# Altium schematic sheet USB.SchDoc
size A4; SheetNumber: 4; SheetTotal: 7
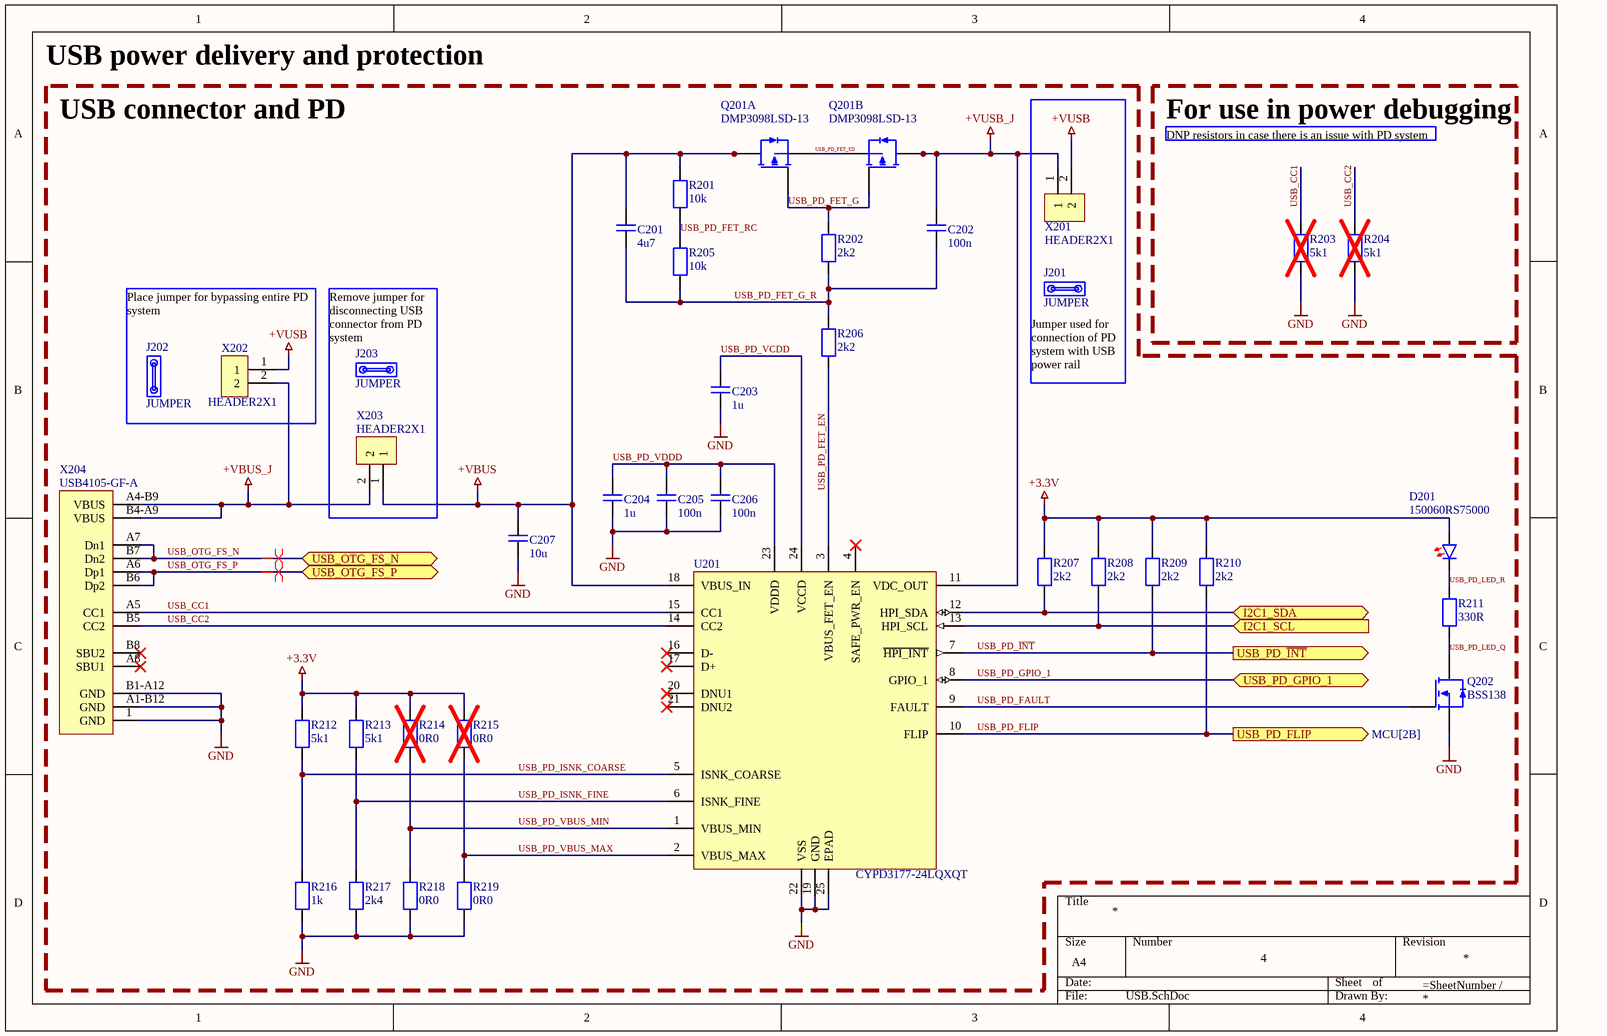
[diagram p0: USB.SchDoc]

## Parts
C201  4u7  [CAPC0603]
C202  100n  [CAPC0603]
C203  1u  [CAPC0603]
C204  1u  [CAPC0603]
C205  100n  [CAPC0603]
C206  100n  [CAPC0603]
C207  10u  [CAPC0603]
D201  150060RS75000  [LED0603]
J201  JUMPER  (mechanical)
J202  JUMPER  (mechanical)
J203  JUMPER  (mechanical)
Q201  DMP3098LSD-13  [SOIC127P620X175-8]  (parts A,B of 2)
Q202  BSS138  [SOT190P240X290-3]
R201  10k  [RESC0603]
R202  2k2  [RESC0603]
R203  5k1  [RESC0603]
R204  5k1  [RESC0603]
R205  10k  [RESC0603]
R206  2k2  [RESC0603]
R207  2k2  [RESC0603]
R208  2k2  [RESC0603]
R209  2k2  [RESC0603]
R210  2k2  [RESC0603]
R211  330R  [RESC0603]
R212  5k1  [RESC0603]
R213  5k1  [RESC0603]
R214  0R0  [RESC0603]
R215  0R0  [RESC0603]
R216  1k  [RESC0603]
R217  2k4  [RESC0603]
R218  0R0  [RESC0603]
R219  0R0  [RESC0603]
U201  CYPD3177-24LQXQT  [QFN50P410X410X100-24EP]
X201  HEADER2X1  [HDRV2W64P254_2X1_508X254X1150]
X202  HEADER2X1  [HDRV2W64P254_2X1_508X254X1150]
X203  HEADER2X1  [HDRV2W64P254_2X1_508X254X1150]
X204  USB4105-GF-A  [GCT_USB4105-GF-A]

## Blocks framed on the sheet
For use in power debugging: R203 R204

## Ports
I2C1_SCL (in, see MCU[1B]), I2C1_SDA (bidir, see MCU[1B]), USB_OTG_FS_N (bidir, see MCU[1B]), USB_OTG_FS_P (bidir, see MCU[1B]), USB_PD_FLIP (out, see MCU[2B]), USB_PD_GPIO_1 (bidir, see MCU[2B]), USB_PD_~{INT} (out, see MCU[2B])

## Nets
+3.3V: D201.2 R207.2 R208.2 R209.2 R210.2 R212.2 R213.2 R214.2 R215.2
+VBUS: C201.2 C207.2 Q201.7(D1) Q201.8(D1) R201.2 U201.18(VBUS_IN) X203.1
+VBUS_J: X202.2 X203.2 X204.A4-B9(VBUS) X204.B4-A9(VBUS)
+VUSB: X201.2 X202.1
+VUSB_J: C202.2 Q201.5(D2) Q201.6(D2) U201.11(VDC_OUT) X201.1
GND: C203.1 C204.1 C205.1 C206.1 C207.1 Q202.2(S) R203.1 R204.1 R216.1 R217.1 R218.1 R219.1 U201.19(GND) U201.22(VSS) U201.25(EPAD) X204.1(GND) X204.A1-B12(GND) X204.B1-A12(GND)
I2C1_SCL: R208.1 U201.13(HPI_SCL) ; port I2C1_SCL
I2C1_SDA: R207.1 U201.12(HPI_SDA) ; port I2C1_SDA
USB_CC1: R203.2 U201.15(CC1) X204.A5(CC1)
USB_CC2: R204.2 U201.14(CC2) X204.B5(CC2)
USB_OTG_FS_N: X204.A7(Dn1) X204.B7(Dn2) ; port USB_OTG_FS_N
USB_OTG_FS_P: X204.A6(Dp1) X204.B6(Dp2) ; port USB_OTG_FS_P
USB_PD_FAULT: Q202.1(G) U201.9(FAULT)
USB_PD_FET_EN: R206.1 U201.3(VBUS_FET_EN)
USB_PD_FET_G: Q201.2(G1) Q201.4(G2) R202.2
USB_PD_FET_G_R: C201.1 C202.1 R202.1 R205.1 R206.2
USB_PD_FET_RC: R201.1 R205.2
USB_PD_FET_SD: Q201.1(S1) Q201.3(S2)
USB_PD_FLIP: R210.1 U201.10(FLIP) ; port USB_PD_FLIP
USB_PD_GPIO_1: U201.8(GPIO_1) ; port USB_PD_GPIO_1
USB_PD_~{INT}: R209.1 U201.7(~{HPI_INT}) ; port USB_PD_~{INT}
USB_PD_ISNK_COARSE: R212.1 R216.2 U201.5(ISNK_COARSE)
USB_PD_ISNK_FINE: R213.1 R217.2 U201.6(ISNK_FINE)
USB_PD_LED_Q: Q202.3(D) R211.1
USB_PD_LED_R: D201.1 R211.2
USB_PD_VBUS_MAX: R215.1 R219.2 U201.2(VBUS_MAX)
USB_PD_VBUS_MIN: R214.1 R218.2 U201.1(VBUS_MIN)
USB_PD_VCDD: C203.2 U201.24(VCCD)
USB_PD_VDDD: C204.2 C205.2 C206.2 U201.23(VDDD)

Not connected (* = marked no-connect by the designer): U201 4(SAFE_PWR_EN)* 16(D-)* 17(D+)* 20(DNU1)* 21(DNU2)*; X204 A8(SBU1)* B8(SBU2)*

## Layout directives
differential pair: USB_OTG_FS_N, USB_OTG_FS_P

## Notes on the sheet
- USB power delivery and protection
- USB connector and PD
- DNP resistors in case there is an issue with PD system
- Jumper used for connection of PD system with USB power rail
- Place jumper for bypassing entire PD system
- Remove jumper for disconnecting USB connector from PD system

## Library data of the parts
C201-C207 = CAPC0603: Ceramic capacitor, VAL?,  VOL?, DIEL?; Checked: Yes; MFR: ?; Supplier: Digi-Key; SPN: ?; MFRN: ?; LCSC Part Number: ?
  C201: Value: 4u7
  C202 C205 C206: Value: 100n
  C203 C204: Value: 1u
  C207: Value: 10u
D201 = HL-PST-1608S9AC-04: LED Red, 2.3V, 20mA; MFR: Würth Elektronik; SPN: 732-4978-2-ND; Checked: Yes; Supplier: Digi-Key; MFRN: 150060RS75000; Value: RED; LCSC Part Number: C497931
J201-J203 = JUMPER: Open Top 3A 2.54mm P=2.54mm Shunts & Jumpers ROHS; MFR: Kycon, Inc.; MFRN: SX1100-A; SPN: 2092-SX1100-A-ND; Value: C5305; Checked: Yes; Supplier: Digi-Key; LCSC Part Number: C5305
Q201 = DMP3098LSD-13: MOSFET 2P-CH 30V 4.4A 8-SOIC; MFR: Diodes Incorporated; SPN: DMP3098LSD-13DITR-ND; Checked: Yes; Supplier: Digi-Key; MFRN: DMP3098LSD-13; Value: DMP3098LSD-13; LCSC Part Number: C531177
Q202 = BSS138: MOSFET N-CH 50V 220MA SOT23-3; MFR: onsemi; SPN: BSS138TR-ND; Checked: Yes; Supplier: Digi-Key; MFRN: BSS138; Value: BSS138; LCSC Part Number: C52895
R201-R219 = RES0603: Thick film resistor, VAL?, POW?; Checked: Yes; MFR: ?; Supplier: Digi-Key; SPN: ?; MFRN: ?; LCSC Part Number: ?
  R201 R205: Value: 10k
  R202 R206-R210: Value: 2k2
  R203 R204 R212 R213: Value: 5k1
  R211: Value: 330R
  R214 R215 R218 R219: Value: 0R0
  R216: Value: 1k
  R217: Value: 2k4
U201 = CYPD3177-24LQXQT: Generic Description; MFR: Infineon Technologies; SPN: 448-CYPD3177-24LQXQTTR-ND; Checked: Yes; Supplier: Digi-Key; MFRN: CYPD3177-24LQXQT; Value: CYPD3177-24LQXQT; LCSC Part Number: C5904158
X201 X202 = HEADER2X1: Pin Header 2x1, P2.54; MFR: Adam Tech; MFRN: PH1-02-UA; SPN: 2057-PH1-02-UA-ND; Value: X6521WV-2x01H-C60D30; Checked: Yes; Supplier: Digi-Key; LCSC Part Number: C2883961
X203 = HEADER2X1: Pin Header 2x1, P2.54; MFR: Adam Tech; MFRN: PH1-02-UA; SPN: 2057-PH1-02-UA-ND; Checked: Yes; Supplier: Digi-Key; Value: HEADER2X1; LCSC Part Number: C2883961
X204 = CONN USB 2.0 TYPE C: USB TYPE-C 3.1, 3A; MFR: GCT; SPN: 2073-USB4105-GF-ATR-ND; Checked: Yes; Supplier: Digi-Key; MFRN: USB4105-GF-A; Value: USB4105-GF-A; LCSC Part Number: C2997433